# EAGLE design controller arduino schema (EAGLE 7.2.0)
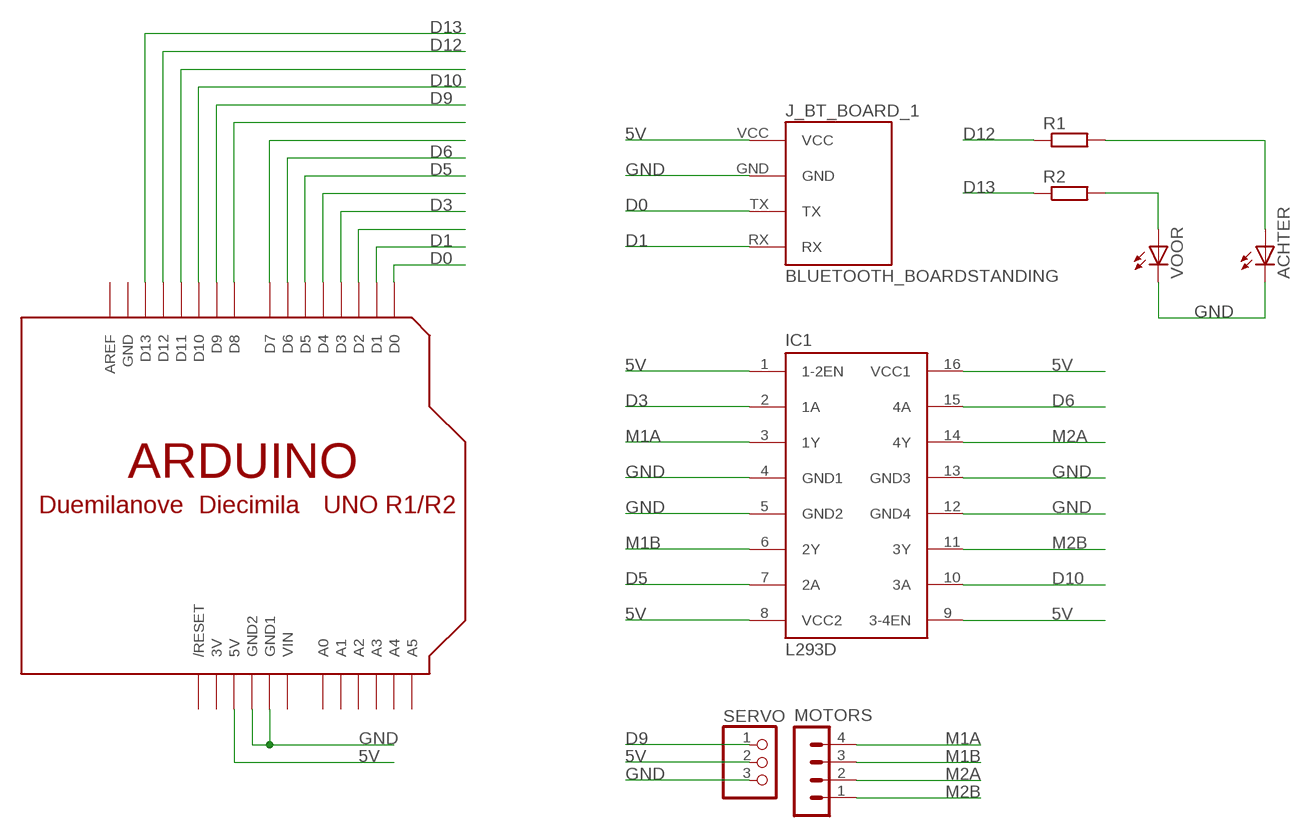
[diagram p0: schematic, sheet 1]

## Parts
ACHTER  LED5MM  [LED5MM]
IC1  L293D  [DIL16]
J_BT_BOARD_1  BLUETOOTH_BOARDSTANDING  [BT_BOARD_FOOTPRINT_STANDING]
MOTORS  MA04-1  [MA04-1]
R1  R-EU_0207/7  [0207/7]
R2  R-EU_0207/7  [0207/7]
SERVO  PINHD-1X3  [1X03]
U$1  ARDUINO-BPLACE  [ARDUINO-BPLACE]
VOOR  LED5MM  [LED5MM]

## Nets
5V: IC1.1(1-2EN) IC1.8(VCC2) IC1.9(3-4EN) IC1.16(VCC1) J_BT_BOARD_1.VCC SERVO.2 U$1.5V
D0: J_BT_BOARD_1.TX U$1.D0
D1: J_BT_BOARD_1.RX U$1.D1
D3: IC1.2(1A) U$1.D3
D5: IC1.7(2A) U$1.D5
D6: IC1.15(4A) U$1.D6
D9: SERVO.1 U$1.D9
D10: IC1.10(3A) U$1.D10
D12: R1.1 U$1.D12
D13: R2.1 U$1.D13
GND: ACHTER.K(C) IC1.4(GND1) IC1.5(GND2) IC1.12(GND4) IC1.13(GND3) J_BT_BOARD_1.GND SERVO.3 U$1.GND1 U$1.GND2 VOOR.K(C)
M1A: IC1.3(1Y) MOTORS.4
M1B: IC1.6(2Y) MOTORS.3
M2A: IC1.14(4Y) MOTORS.2
M2B: IC1.11(3Y) MOTORS.1
N$1: R2.2 VOOR.A
N$2: ACHTER.A R1.2
N$8: U$1.D2
N$11: U$1.D4
N$14: U$1.D7
N$16: U$1.D8
N$19: U$1.D11
Unconnected: U$1.A0 U$1.A1 U$1.A2 U$1.A3 U$1.A4 U$1.A5 U$1.AREF U$1.RESET(/RESET)

## Power pins joined to a net without a drawn wire
3V: U$1.3V
GND: U$1.GND
VIN: U$1.VIN

## Library data of the parts
ACHTER VOOR = adafruit:LED: LED OSRAM: - CHIPLED LG R971, LG N971, LY N971, LG Q971, LY Q971, LO R971, LY R971 LH N974, LH R974 LS Q976, LO Q976, LY Q976 LO Q996 - Hyper CHIPLED LW Q18S LB Q993, LB Q99A, LB R99A - SideLED LS A670, LO A670, LY A670, LG A670, LP A670 LB A673, LV A673, LT A673, LW A673 LH A674 LY A675 LS A676, LA A676, LO A676, LY A676, LW A676 LS A679, LY A679, LG A679 - Hyper Micro SIDELED® LS Y876, LA Y876, LO Y876, LY Y876 LT Y87S - SmartLED LW L88C, LW L88S LB L89C, LB L89S, LG L890 LS L89K, LO L89K, LY L89K LS L896, LA L896, LO L896, LY L896 - TOPLED LS T670, LO T670, LY T670, LG T670, LP T670 LSG T670, LSP T670, LSY T670, LOP T670, LYG T670 LG T671, LOG T671, LSG T671 LB T673, LV T673, LT T673, LW T673 LH T674 LS T676, LA T676, LO T676, LY T676, LB T676, LH T676, LSB T676, LW T676 LB T67C, LV T67C, LT T67C, LS T67K, LO T67K, LY T67K, LW E67C LS E67B, LA E67B, LO E67B, LY E67B, LB E67C, LV E67C, LT E67C LW T67C LS T679, LY T679, LG T679 LS T770, LO T770, LY T770, LG T770, LP T770 LB T773, LV T773, LT T773, LW T773 LH T774 LS E675, LA E675, LY E675, LS T675 LS T776, LA T776, LO T776, LY T776, LB T776 LHGB T686 LT T68C, LB T68C - Hyper Mini TOPLED® LB M676 - Mini TOPLED Santana® LG M470 LS M47K, LO M47K, LY M47K Source: http://www.osram.convergy.de/
IC1 = st-microelectronics:L293D: PUSH-PULL 4 CHANNEL DRIVER; MPN: L293D; OC_FARNELL: 9589619; OC_NEWARK: 56P8249
J_BT_BOARD_1 = Bluetooth HC-05:BLUETOOTH_BOARD: Bluetooth Board V1.05
MOTORS = con-lstb:MA04-1: PIN HEADER; OC_FARNELL: unknown; OC_NEWARK: unknown
R1 R2 = rcl:R-EU_: RESISTOR, European symbol
SERVO = adafruit:PINHD-1X3: PIN HEADER
U$1 = adafruit:ARDUINO: Arduino Diecimila/Duemilanove Make a shield with ease, this package has all the named pins as well as the two mounting drill holes and an outline of the USB and DC power connector. The outline is on the DIMENSION layer, so if your board house uses it they will cut the outline to match. http://www.ladyada.net/library/pcb/eaglelibrary.html

## Board
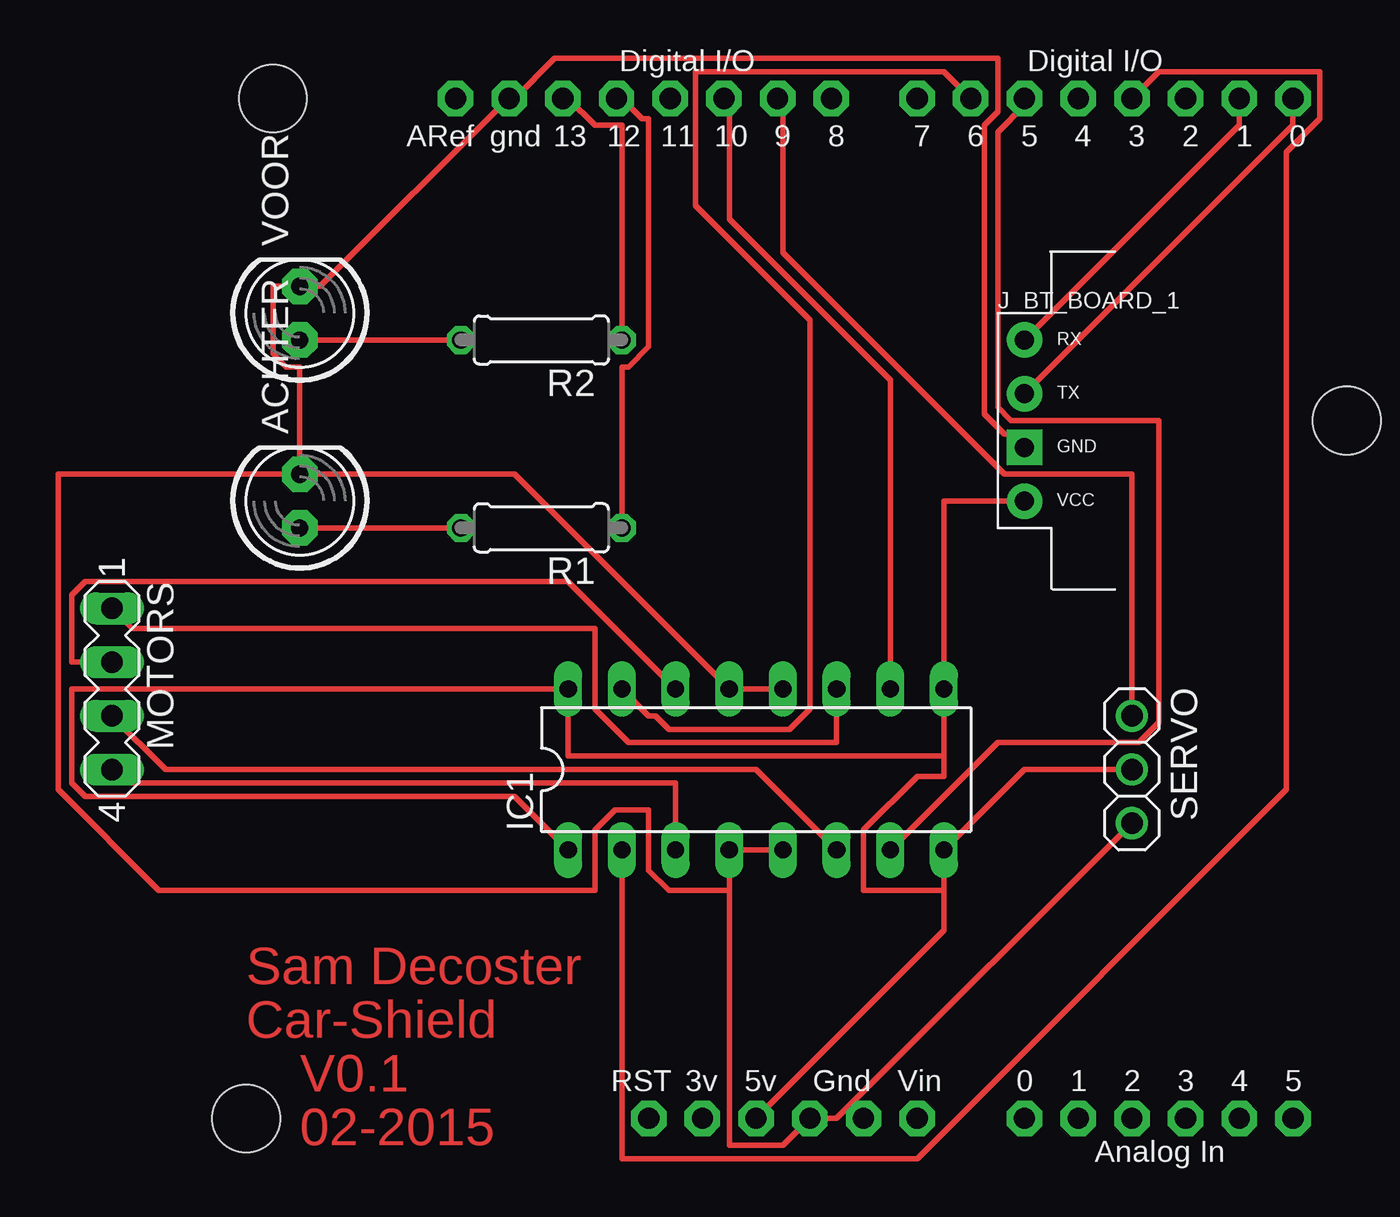
[diagram p1: board, top side]
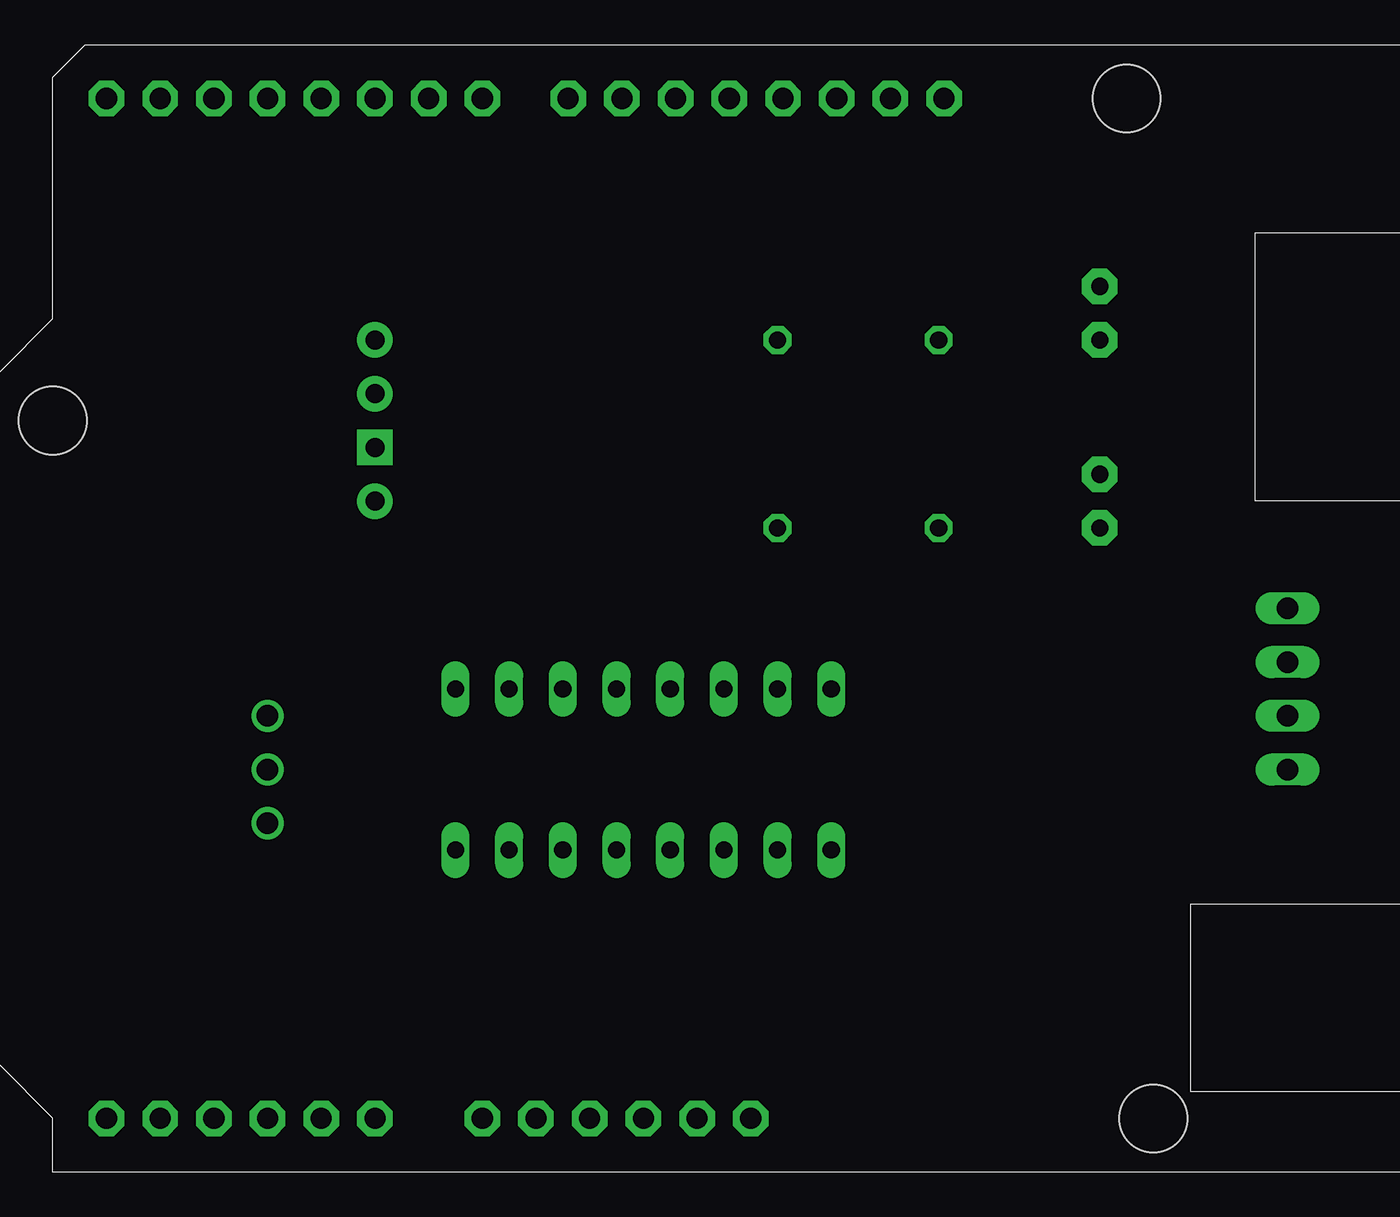
[diagram p2: board, bottom side, seen from below]

No outline drawn. Coordinates in mm, seen from the top.
Copper layers (1*16): Top 0.035mm / dielectric 1.5mm / Bottom 0.035mm
Design rules "default": minimum track width 10mil, minimum drill 24mil, track to track 8mil, track to pad 8mil, pad to pad 8mil, via to via 8mil, smd to smd 8mil, copper to edge 40mil, drill to drill 8mil, minimum pad ring 10mil, minimum via ring 8mil, stop-mask expansion 4mil, vias tented up to drill 0mil, thermal gap 10mil

### Footprints (pad centres in the part's own frame; a part is rotated, then mirrored left to right if it is on the bottom)
LED5MM = drill 0.813 pad 1.676 octagon: A -1.27,0; K 1.27,0
DIL16 = drill 0.813 long: 1 -8.89,-3.81; 2 -6.35,-3.81; 3 -3.81,-3.81; 4 -1.27,-3.81; 5 1.27,-3.81; 6 3.81,-3.81; 7 6.35,-3.81; 8 8.89,-3.81; 9 8.89,3.81; 10 6.35,3.81; 11 3.81,3.81; 12 1.27,3.81; 13 -1.27,3.81; 14 -3.81,3.81; 15 -6.35,3.81; 16 -8.89,3.81
BT_BOARD_FOOTPRINT_STANDING = drill 0.9 pad 1.676 square: GND -3.81,-1.27 | drill 0.9 pad 1.676: RX -3.81,3.81; TX -3.81,1.27; VCC -3.81,-3.81
MA04-1 = drill 1.016 long: 1 -3.81,0; 2 -1.27,0; 3 1.27,0; 4 3.81,0
0207/7 = drill 0.813 octagon: 1 -3.81,0; 2 3.81,0
1X03 = drill 1.016: 1 -2.54,0; 2 0,0; 3 2.54,0
ARDUINO-BPLACE = drill 1 pad 1.676 octagon: 3V 35.56,2.54; 5V 38.1,2.54; A0 50.8,2.54; A1 53.34,2.54; A2 55.88,2.54; A3 58.42,2.54; A4 60.96,2.54; A5 63.5,2.54; AREF 23.876,50.8; D0 63.5,50.8; D1 60.96,50.8; D2 58.42,50.8; D3 55.88,50.8; D4 53.34,50.8; D5 50.8,50.8; D6 48.26,50.8; D7 45.72,50.8; D8 41.656,50.8; D9 39.116,50.8; D10 36.576,50.8; D11 34.036,50.8; D12 31.496,50.8; D13 28.956,50.8; GND 26.416,50.8; GND1 43.18,2.54; GND2 40.64,2.54; RESET 33.02,2.54; VIN 45.72,2.54 | hole 3.2: 15.24,50.8; 66.04,35.56; 13.97,2.54

### Placement (x,y rotation side)
ACHTER  16.51,31.75 90 top
IC1  38.1,19.05 0 top
J_BT_BOARD_1  54.61,35.56 0 top
MOTORS  7.62,22.86 270 top
R1  27.94,30.48 180 top
R2  27.94,39.37 180 top
SERVO  55.88,19.05 270 top
U$1  0,0 0 top
VOOR  16.51,40.64 90 top

### Tracks (layer width: path | path; a pad name or v marks a point on that pad's centre or on a via)
5V
  Top 0.254: IC1.1 26.67,17.78 6.35,17.78 5.71,18.41 5.71,22.86 IC1.16 29.21,19.68 46.99,19.68 | J_BT_BOARD_1.VCC 46.99,31.75 IC1.9 46.99,19.68 | SERVO.2 50.8,19.05 IC1.8 46.99,13.34 | U$1.5V 46.99,11.43 46.99,13.34 | 46.99,19.68 46.99,18.73 45.72,18.73 43.18,16.19 43.18,13.34 46.99,13.34
D0
  Top 0.254: J_BT_BOARD_1.TX 63.5,49.53 U$1.D0
D1
  Top 0.254: J_BT_BOARD_1.RX 60.96,49.53 U$1.D1
D3
  Top 0.254: IC1.2 31.75,0.64 45.72,0.64 63.18,18.1 63.18,48.26 64.77,49.85 64.77,52.07 57.15,52.07 U$1.D3
D5
  Top 0.254: IC1.7 49.53,20.32 56.2,20.32 57.15,21.27 57.15,35.56 50.16,35.56 49.53,36.2 49.53,49.21 50.8,50.48 U$1.D5
D6
  Top 0.254: IC1.15 33.02,21.59 33.34,21.59 33.97,20.95 39.69,20.95 40.64,21.91 40.64,40.32 35.24,45.72 35.24,52.07 46.99,52.07 U$1.D6
D9
  Top 0.254: SERVO.1 55.88,33.02 49.85,33.02 39.37,43.5 39.37,50.8 U$1.D9
D10
  Top 0.254: IC1.10 44.45,37.47 36.83,45.09 36.83,50.8 U$1.D10
D12
  Top 0.254: R1.1 31.75,38.1 32.07,38.1 33.02,39.05 33.02,49.85 32.7,49.85 31.75,50.8 U$1.D12
D13
  Top 0.254: R2.1 31.75,49.53 30.48,49.53 29.21,50.8 U$1.D13
GND
  Top 0.254: IC1.5 IC1.4 36.83,13.34 | 42.55,3.17 41.91,2.54 U$1.GND2 39.37,1.27 36.83,1.27 36.83,13.34 | 42.55,3.17 SERVO.3 | 42.55,3.17 U$1.GND1 | IC1.12 IC1.13 26.67,33.02 ACHTER.K | ACHTER.K 16.51,38.1 15.88,38.1 15.24,38.73 15.24,41.91 VOOR.K 17.46,41.91 26.35,50.8 U$1.GND 26.67,50.8 28.57,52.7 49.53,52.7 49.53,50.16 48.9,49.53 48.9,35.88 49.85,34.92 50.16,34.92 J_BT_BOARD_1.GND | 36.83,13.34 33.97,13.34 33.02,14.29 33.02,17.14 31.43,17.14 30.48,16.19 30.48,13.34 9.84,13.34 5.08,18.1 5.08,33.02 ACHTER.K
M1A
  Top 0.254: IC1.3 34.29,18.41 8.26,18.41 MOTORS.4
M1B
  Top 0.254: IC1.6 38.1,19.05 10.16,19.05 MOTORS.3
M2A
  Top 0.254: IC1.14 29.21,27.94 6.35,27.94 5.71,27.3 5.71,24.13 MOTORS.2
M2B
  Top 0.254: IC1.11 41.91,20.32 32.07,20.32 30.48,21.91 30.48,25.72 8.57,25.72 MOTORS.1
N$1
  Top 0.254: VOOR.A R2.2
N$2
  Top 0.254: ACHTER.A R1.2

### Text on the board
Top: Sam Decoster | Car-Shield | V0.1 | 02-2015